# Altium schematic sheet LED_GND_ZLayer_switch.SchDoc
size A4
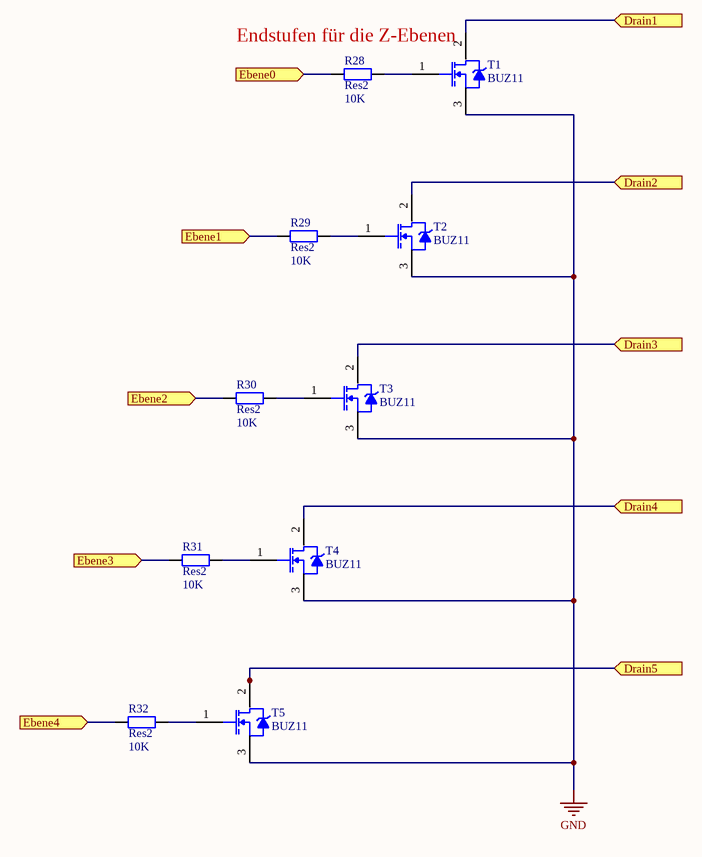
[diagram p0: LED_GND_ZLayer_switch.SchDoc]

## Parts
R28  Res2  value 10K  [AXIAL-0.4]
R29  Res2  value 10K  [AXIAL-0.4]
R30  Res2  value 10K  [AXIAL-0.4]
R31  Res2  value 10K  [AXIAL-0.4]
R32  Res2  value 10K  [AXIAL-0.4]
T1  BUZ11  [TO220]
T2  BUZ11  [TO220]
T3  BUZ11  [TO220]
T4  BUZ11  [TO220]
T5  BUZ11  [TO220]

## Ports
Drain1 (in), Drain2 (in), Drain3 (in), Drain4 (in), Drain5 (in), Ebene0 (in), Ebene1 (in), Ebene2 (in), Ebene3 (in), Ebene4 (in)

## Nets
GND: T1.3(S) T2.3(S) T3.3(S) T4.3(S) T5.3(S)
Drain1: T1.2(D) ; port Drain1
Drain2: T2.2(D) ; port Drain2
Drain3: T3.2(D) ; port Drain3
Drain4: T4.2(D) ; port Drain4
Drain5: T5.2(D) ; port Drain5
Ebene0: R28.1 ; port Ebene0
Ebene1: R29.1 ; port Ebene1
Ebene2: R30.1 ; port Ebene2
Ebene3: R31.1 ; port Ebene3
Ebene4: R32.1 ; port Ebene4
NetR28_2: R28.2 T1.1(G)
NetR29_2: R29.2 T2.1(G)
NetR30_2: R30.2 T3.1(G)
NetR31_2: R31.2 T4.1(G)
NetR32_2: R32.2 T5.1(G)

## Notes on the sheet
- (near T1) Endstufen für die Z-Ebenen

## Library data of the parts
R28-R32 = Res2: Resistor; Published: 8-Jun-2000; LatestRevisionDate: 17-Jul-2002; LatestRevisionNote: Re-released for DXP Platform.; PackageReference: AXIAL-0.4; Publisher: Altium Limited; PackageDescription: Axial Device, Thru-Hole; 2 Leads; 0.4 in Pin Spacing
T1-T5 = N-MOSFET: MOSFET